# Altium schematic sheet RFM22.SchDoc
size A4
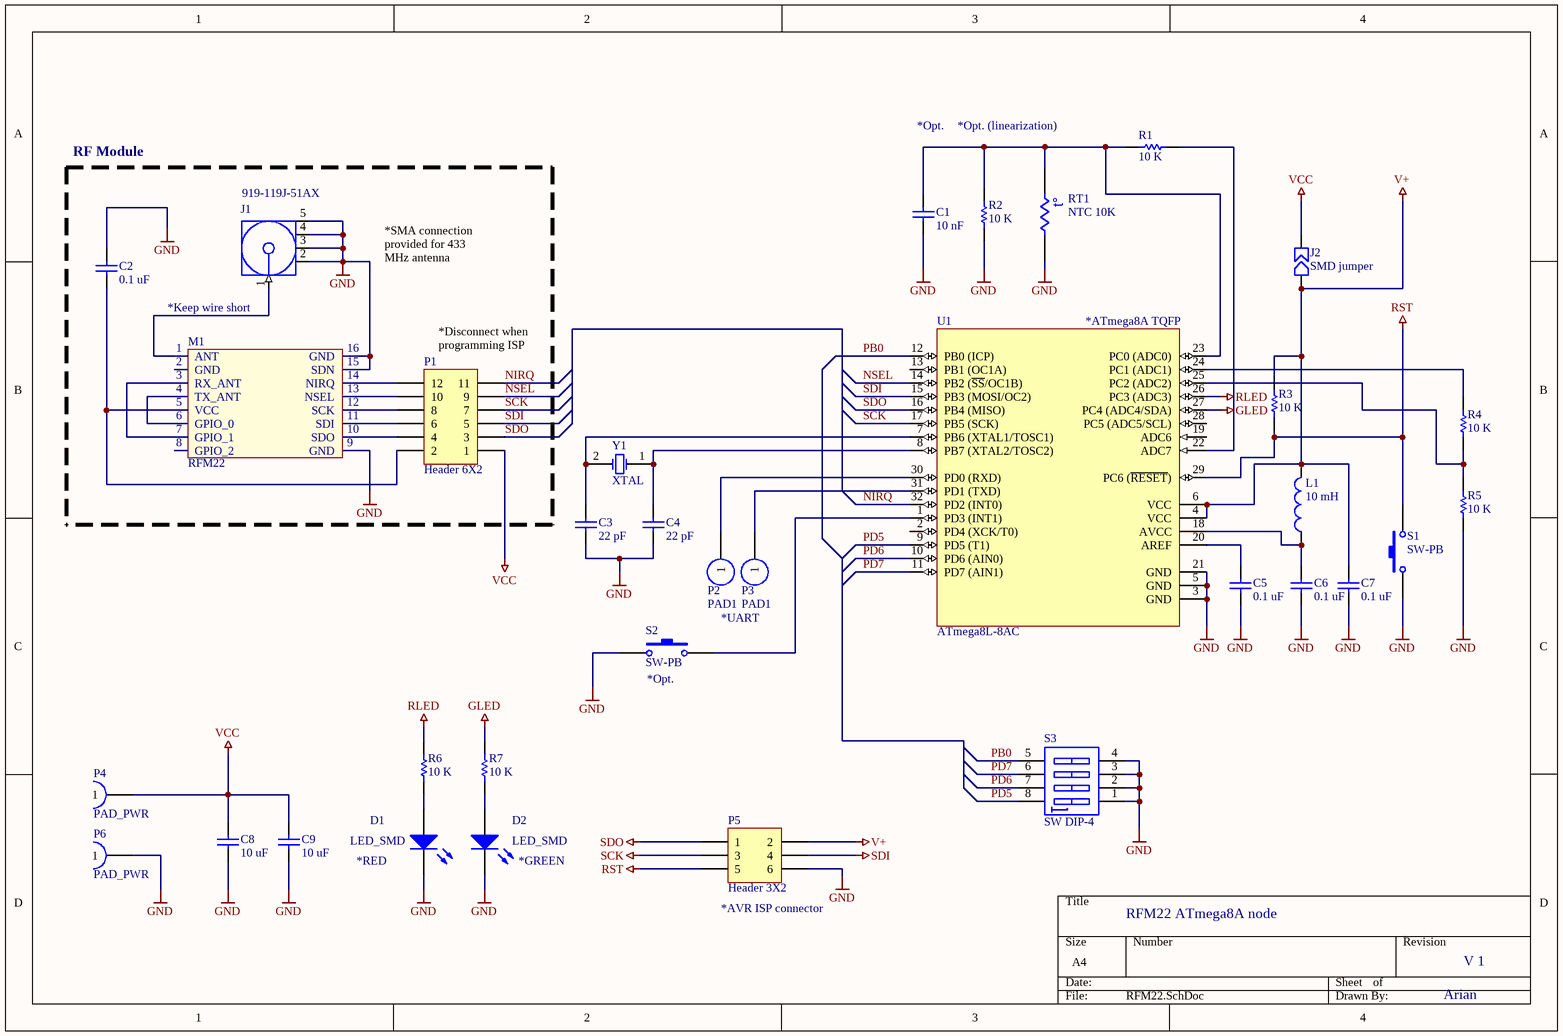
[diagram p0: RFM22.SchDoc]

## Parts
C1  10 nF  [C0805]
C2  0.1 uF  [C0805]
C3  22 pF  [C0805]
C4  22 pF  [C0805]
C5  0.1 uF  [C0805]
C6  0.1 uF  [C0805]
C7  0.1 uF  [C0805]
C8  10 uF  [C0805]
C9  10 uF  [C0805]
D1  LED_SMD  [LED-0805]
D2  LED_SMD  [LED-0805]
J1  919-119J-51AX  [919-119J]
J2  SMD jumper  [SMD jmp 2]
L1  10 mH  [1812]
M1  RFM22  [RFM22_S2]
P1  Header 6X2  [HDR2X6]
P2  PAD1  [PAD1]
P3  PAD1  [PAD1]
P4  PAD_PWR  [PAD_PWR]
P5  Header 3X2  [HDR2X3]
P6  PAD_PWR  [PAD_PWR]
R1  10 K  [R0805]
R2  10 K  [R0805]
R3  10 K  [R0805]
R4  10 K  [R0805]
R5  10 K  [R0805]
R6  10 K  [R0805]
R7  10 K  [R0805]
RT1  NTC 10K  [R1206]
S1  SW-PB  [SW_ts017a]
S2  SW-PB  [SW_ts017a]
S3  SW DIP-4  [DIP-8]
U1  ATmega8L-8AC  [32A_N]
Y1  XTAL  [X32768_normal]

## Blocks framed on the sheet
RF Module: C2 J1 M1 P1

## Nets
GLED: R7.1 U1.27(PC4_(ADC4/SDA))
GND: C1.1 C2.2 C3.1 C4.1 C5.1 C6.1 C7.1 C8.1 C9.1 D1.2(K) D2.2(K) J1.2(GND) J1.3(GND) J1.4(GND) J1.5(GND) M1.9(GND) M1.15(SDN) M1.16(GND) P5.6 P6.1 R2.2 R5.1 RT1.2 S1.1 S2.1 S3.1(A1) S3.2(A2) S3.3(A3) S3.4(A4) U1.3(GND) U1.5(GND) U1.21(GND)
RLED: R6.1 U1.26(PC3_(ADC3))
RST: P5.5 R3.2 S1.2 U1.29(PC6_(~{RESET}))
SCK: P1.7 P5.3 U1.17(PB5_(SCK))
SDI: P1.5 P5.4 U1.15(PB3_(MOSI/OC2))
SDO: P1.3 P5.1 U1.16(PB4_(MISO))
V+: C7.2 J2.1 L1.2 P5.2 R3.1 U1.4(VCC) U1.6(VCC)
VCC: C8.2 C9.2 J2.2 P1.1 P4.1
NIRQ: P1.11 U1.32(PD2_(INT0))
NSEL: P1.9 U1.14(PB2_(~{SS}/OC1B))
PB0: S3.5(B4) U1.12(PB0_(ICP))
PD5: S3.8(B1) U1.9(PD5_(T1))
PD6: S3.7(B2) U1.10(PD6_(AIN0))
PD7: S3.6(B3) U1.11(PD7_(AIN1))
NetC1_2: C1.2 R1.1 R2.1 RT1.1 U1.23(PC0_(ADC0))
NetC2_1: C2.1 M1.5(VCC) P1.2
NetC3_2: C3.2 U1.7(PB6_(XTAL1/TOSC1)) Y1.2(OSC2)
NetC4_2: C4.2 U1.8(PB7_(XTAL2/TOSC2)) Y1.1(OSC1)
NetC5_2: C5.2 U1.20(AREF)
NetC6_2: C6.2 L1.1 U1.18(AVCC)
NetD1_1: D1.1(A) R6.2
NetD2_1: D2.1(A) R7.2
NetJ1_1: J1.1(Signal) M1.1(ANT)
NetM1_3: M1.3(RX_ANT) M1.7(GPIO_1)
NetM1_4: M1.4(TX_ANT) M1.6(GPIO_0)
NetM1_10: M1.10(SDO) P1.4
NetM1_11: M1.11(SDI) P1.6
NetM1_12: M1.12(SCK) P1.8
NetM1_13: M1.13(NSEL) P1.10
NetM1_14: M1.14(NIRQ) P1.12
NetP2_1: P2.1 U1.30(PD0_(RXD))
NetP3_1: P3.1 U1.31(PD1_(TXD))
NetR1_2: R1.2 U1.22(ADC7)
NetR4_1: R4.1 R5.2 U1.25(PC2_(ADC2))
NetR4_2: R4.2 U1.24(PC1_(ADC1))
NetS2_2: S2.2 U1.1(PD3_(INT1))

Not connected (* = marked no-connect by the designer): M1 2(GND) 8(GPIO_2); U1 2(PD4_(XCK/T0)) 13(PB1_(OC1A)) 19(ADC6) 28(PC5_(ADC5/SCL))

## Notes on the sheet
- *Opt.
- *Opt. (linearization)
- *Keep wire short
- *SMA connection provided for 433 MHz antenna
- (near P1) *Disconnect when programming ISP
- (near U1) *ATmega8A TQFP
- *UART
- (near S2) *Opt.
- *RED
- (near D2) *GREEN
- (near P5) *AVR ISP connector
- RFM22 ATmega8A node
- V 1
- Arian
- (in symbol Res Thermal) t°

## Library data of the parts
C1-C9 = Cap: Capacitor; Value: 100pF; Published: 8-Jun-2000; LatestRevisionDate: 17-Jul-2002; LatestRevisionNote: Re-released for DXP Platform.; PackageReference: RAD-0.3; Publisher: Altium Limited
D1 D2 = LED_SMD: Typical SMD LED; Published: 8-Jun-2000; LatestRevisionDate: 08-Jul-2005; LatestRevisionNote: Mech Layer 1 removed.; PackageReference: LED-0; Publisher: Altium Limited
J1 = 919-119J-51AX: MCX RF Coaxial PCB Connector, Thru-Hole, Right-Angle Mount Socket, Blunt Post Terminal, 50 Ohm Impedance; PCB_Layout: Complies with manufacturer's recommendation.; DrillSize: Corresponds to nominal value.; Published: 15-Jul-2004; DatasheetDocument: 30-May-2003; PackageDocument: 04-Jul-1999; PackageReference: 919-119J; Publisher: Altium Limited; ComponentLink1Description: Manufacturer Link; ComponentLink1URL: http://www.amphenolrf.com/; ComponentLink2Description: Datasheet; ComponentLink2URL: http://www.amphenolrf.com/pdf/21.pdf
L1 = Inductor: Code_IEC: 1005; Value: 10mH; Published: 8-Jun-2000; LatestRevisionDate: 17-Jul-2002; LatestRevisionNote: Re-released for DXP Platform.; PackageReference: 0402-A; Publisher: Altium Limited; Code_JEITA: 0402
P1 = Header 6X2: Header, 6-Pin, Dual row; LatestRevisionDate: 17-Jul-2002; LatestRevisionNote: Re-released for DXP Platform.; Publisher: Altium Limited
P2 P3 = PAD1: PAD connection; LatestRevisionDate: 17-Jul-2002; LatestRevisionNote: Re-released for DXP Platform.; Publisher: Altium Limited
P4 P6 = PAD_PWR: PAD connection; LatestRevisionDate: 17-Jul-2002; LatestRevisionNote: Re-released for DXP Platform.; Publisher: Altium Limited
P5 = Header 3X2: Header, 3-Pin, Dual row; LatestRevisionDate: 17-Jul-2002; LatestRevisionNote: Re-released for DXP Platform.; Publisher: Altium Limited
R1-R7 = Res1: Resistor; Value: 1K; Published: 8-Jun-2000; LatestRevisionDate: 17-Jul-2002; LatestRevisionNote: Re-released for DXP Platform.; PackageReference: AXIAL-0.3; Publisher: Altium Limited
RT1 = Res Thermal: Thermistor; Published: 24-Mar-1999; LatestRevisionDate: 29-May-2009; LatestRevisionNote: IPC-7351 Footprint Added.; PackageVersion: Mar-2003; PackageReference: 6-0805; Publisher: Altium Limited; PackageDescription: Chip Resistor 0805 Case Size; Code_IPC: RESC2012
S1 S2 = SW-PB: Switch; Published: 24-Mar-1999; LatestRevisionDate: 17-Jul-2002; LatestRevisionNote: Re-released for DXP Platform.; PackageReference: SPST-2; Publisher: Altium Limited
S3 = SW DIP-4: DIP Switch, 4 Position, SPST; Published: 24-Mar-1999; LatestRevisionDate: 17-Jul-2002; LatestRevisionNote: Re-released for DXP Platform.; PackageReference: SO8; Publisher: Altium Limited; Code_JEDEC: MS-012-AA; Code_IPC: SO8
U1 = ATmega8L-8AC: 8-Bit AVR Microcontroller with 8K Bytes of In-System Programmable Flash Memory; Published: 17-Sep-2003; LatestRevisionDate: 13-Apr-2006; LatestRevisionNote: IPC-7351 Footprint Added.; DatasheetVersion: 2486H-AVR-09/02; PackageVersion: revB, Oct-2001; PackageReference: 32A; Publisher: Altium Limited; PackageDescription: 32-Pin Thin Quad Flat Pack 0.8 mm Pitch; Code_JEDEC: MS-026-ABA; ComponentLink1Description: Manufacturer Link; ComponentLink1URL: http://www.atmel.com; ComponentLink2Description: Datasheet; ComponentLink2URL: http://www.atmel.com/dyn/resources/prod_documents/doc2486.pdf
Y1 = XTAL: Crystal Oscillator; Published: 8-Jun-2000; LatestRevisionDate: 17-Jul-2002; LatestRevisionNote: Re-released for DXP Platform.; PackageReference: R38; Publisher: Altium Limited